# Altium schematic sheet 2014_ConnecteurChargeur.SchDoc
size A4
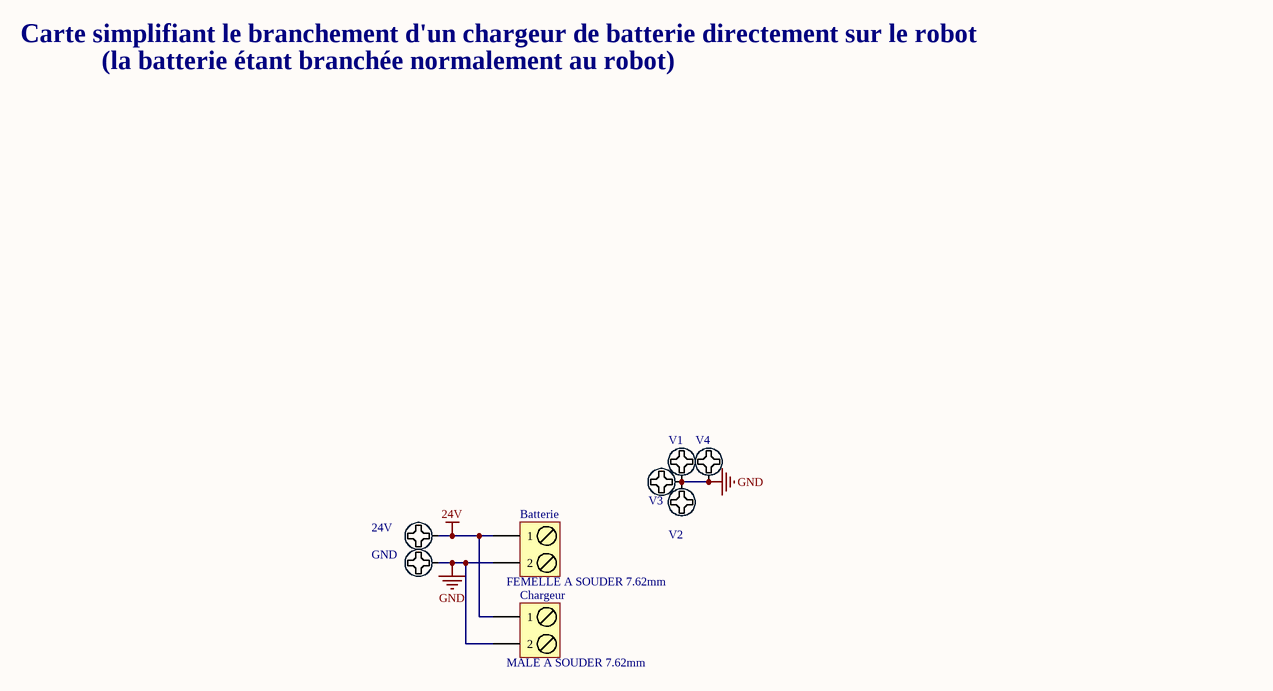
[diagram p0: 2014_ConnecteurChargeur.SchDoc]

## Parts
24V  Pad_M3  [M3x6mm_8 vias]  (value not drawn)
Batterie  FEMELLE A SOUDER 7.62mm  [BORNIER2_FEM_COUDE]
Chargeur  MALE A SOUDER 7.62mm  [BORNIER2_FEM_COUDE]
GND  Pad_M3  [M3x6mm_8 vias]  (value not drawn)
V1  Pad_M3  [M3x6mm_8 vias]  (value not drawn)
V2  Pad_M3  [M3x6mm_8 vias]  (value not drawn)
V3  Pad_M3  [M3x6mm_8 vias]  (value not drawn)
V4  Pad_M3  [M3x6mm_8 vias]  (value not drawn)

## Nets
24V: 24V.1 Batterie.1 Chargeur.1
GND: Batterie.2 Chargeur.2 GND.1 V1.1 V2.1 V3.1 V4.1

## Notes on the sheet
- Carte simplifiant le branchement d'un chargeur de batterie directement sur le robot
- (la batterie étant branchée normalement au robot)

## Library data of the parts
24V GND V1-V4 = Vis M3 X 6mm _TORX_Tête 6mm: Publisher: Damien Guitton
Batterie Chargeur = BORNIER2: Terminal blocks, 2 pins, pitch=5mm